# EAGLE design moc2 (EAGLE 8.6.2)
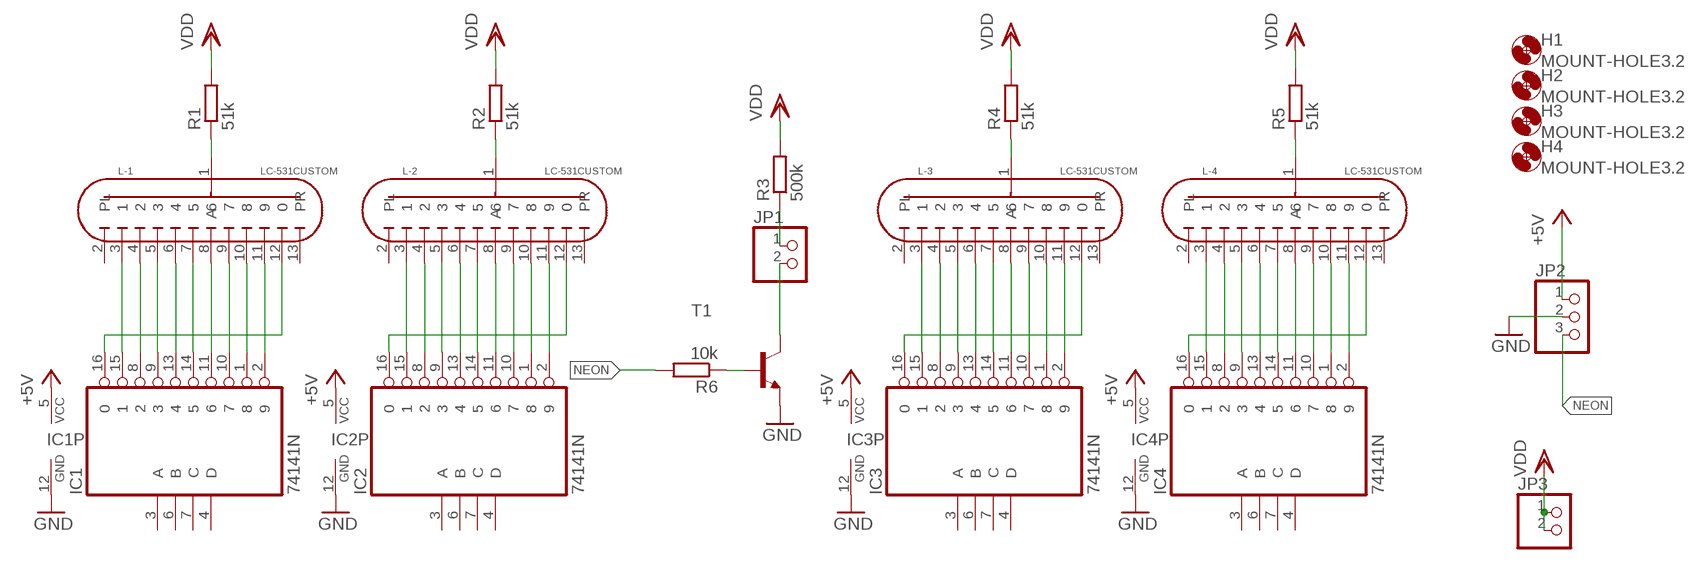
[diagram p0: schematic, sheet 1]

## Parts
H1  MOUNT-HOLE3.2  [3,2]
H2  MOUNT-HOLE3.2  [3,2]
H3  MOUNT-HOLE3.2  [3,2]
H4  MOUNT-HOLE3.2  [3,2]
IC1  74141N  [DIL16]
IC2  74141N  [DIL16]
IC3  74141N  [DIL16]
IC4  74141N  [DIL16]
JP1  PINHD-1X2  [1X02]
JP2  PINHD-1X3/90  [1X03/90]
JP3  PINHD-1X2/90  [1X02/90]
L-1  LC-531CUSTOM  [LC-531_PIN_SOCKET]
L-2  LC-531CUSTOM  [LC-531_PIN_SOCKET]
L-3  LC-531CUSTOM  [LC-531_PIN_SOCKET]
L-4  LC-531CUSTOM  [LC-531_PIN_SOCKET]
R1  51k  R-EU_0207/10  [0207/10]
R2  51k  R-EU_0207/10  [0207/10]
R3  500k  R-EU_0207/10  [0207/10]
R4  51k  R-EU_0207/10  [0207/10]
R5  51k  R-EU_0207/10  [0207/10]
R6  10k  R-EU_0207/10  [0207/10]
T1  BF422-NPN-TO92-BCE  [TO92-BCE]

## Nets
+5V: IC1.5(VCC) IC2.5(VCC) IC3.5(VCC) IC4.5(VCC) JP2.1
GND: IC1.12(GND) IC2.12(GND) IC3.12(GND) IC4.12(GND) JP2.2 T1.E
N$1: IC1.15 L-1.3
N$2: IC1.8 L-1.4
N$3: IC1.9 L-1.5
N$4: IC1.13 L-1.6
N$5: IC1.14 L-1.7
N$6: IC1.11 L-1.8
N$7: IC1.10 L-1.9
N$8: IC1.1 L-1.10
N$9: IC1.2 L-1.11
N$10: IC1.16 L-1.12
N$11: L-1.1(A) R1.1
N$12: IC2.15 L-2.3
N$13: IC2.8 L-2.4
N$14: IC2.9 L-2.5
N$15: IC2.13 L-2.6
N$16: IC2.14 L-2.7
N$17: IC2.11 L-2.8
N$18: IC2.10 L-2.9
N$19: IC2.1 L-2.10
N$20: IC2.2 L-2.11
N$21: IC2.16 L-2.12
N$22: L-2.1(A) R2.1
N$23: JP1.2 T1.C
N$24: JP1.1 R3.1
N$25: IC3.15 L-3.3
N$26: IC3.8 L-3.4
N$27: IC3.9 L-3.5
N$28: IC3.13 L-3.6
N$29: IC3.14 L-3.7
N$30: IC3.11 L-3.8
N$31: IC3.10 L-3.9
N$32: IC3.1 L-3.10
N$33: IC3.2 L-3.11
N$34: IC3.16 L-3.12
N$35: L-3.1(A) R4.1
N$36: IC4.15 L-4.3
N$37: IC4.8 L-4.4
N$38: IC4.9 L-4.5
N$39: IC4.13 L-4.6
N$40: IC4.14 L-4.7
N$41: IC4.11 L-4.8
N$42: IC4.10 L-4.9
N$43: IC4.1 L-4.10
N$44: IC4.2 L-4.11
N$45: IC4.16 L-4.12
N$46: L-4.1(A) R5.1
N$49: R6.1 T1.B
NEON: JP2.3 R6.2
VDD: JP3.1 JP3.2 R1.2 R2.2 R3.2 R4.2 R5.2
Unconnected: IC1.3(A) IC1.4(D) IC1.6(B) IC1.7(C) IC2.3(A) IC2.4(D) IC2.6(B) IC2.7(C) IC3.3(A) IC3.4(D) IC3.6(B) IC3.7(C) IC4.3(A) IC4.4(D) IC4.6(B) IC4.7(C) L-1.2(PL) L-1.13(PR) L-2.2(PL) L-2.13(PR) L-3.2(PL) L-3.13(PR) L-4.2(PL) L-4.13(PR)

## Library data of the parts
H1-H4 = holes:MOUNT-HOLE: MOUNTING HOLE with drill center marker
IC1 IC3 = 74xx-eu:74*141: BCD to decimal DECODER/DRIVER; SPICEPREFIX: X
IC2 IC4 = 74xx-eu:74*141: BCD to decimal DECODER/DRIVER
JP1 JP3 = pinhead:PINHD-1X2: PIN HEADER
JP2 = pinhead:PINHD-1X3: PIN HEADER
L-1-L-4 = Nixie LC-531:LC-531: NIXIE DOLAM LC-531
R1-R6 = resistor:R-EU_: RESISTOR, European symbol
T1 = transistor:*-NPN-: NPN Transistror BF959 corrected 2008.03.06

## Board
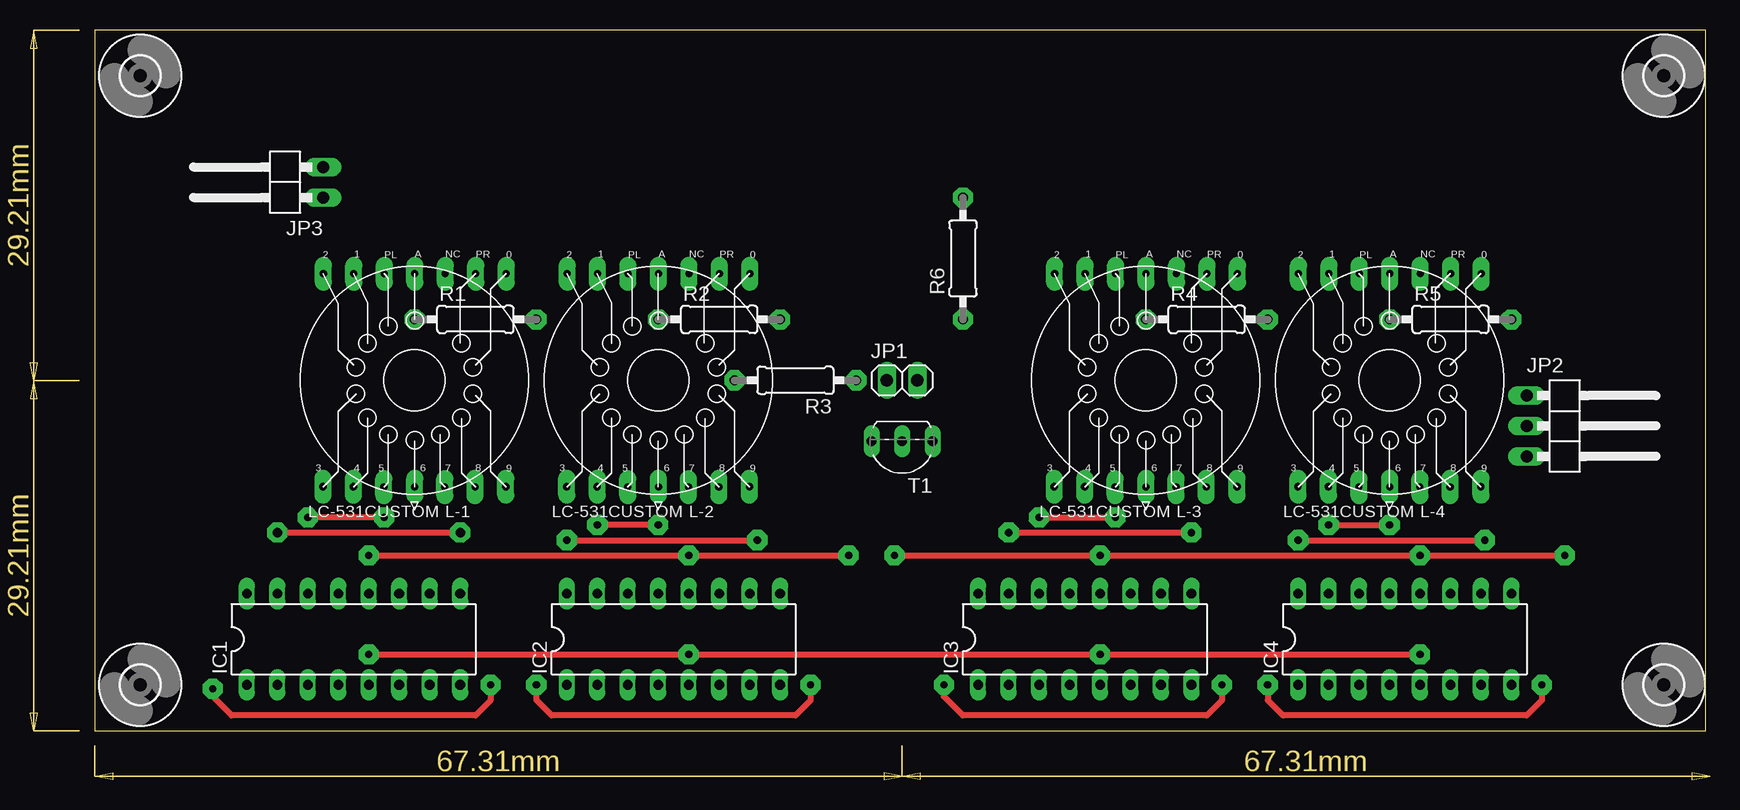
[diagram p1: board, top side]
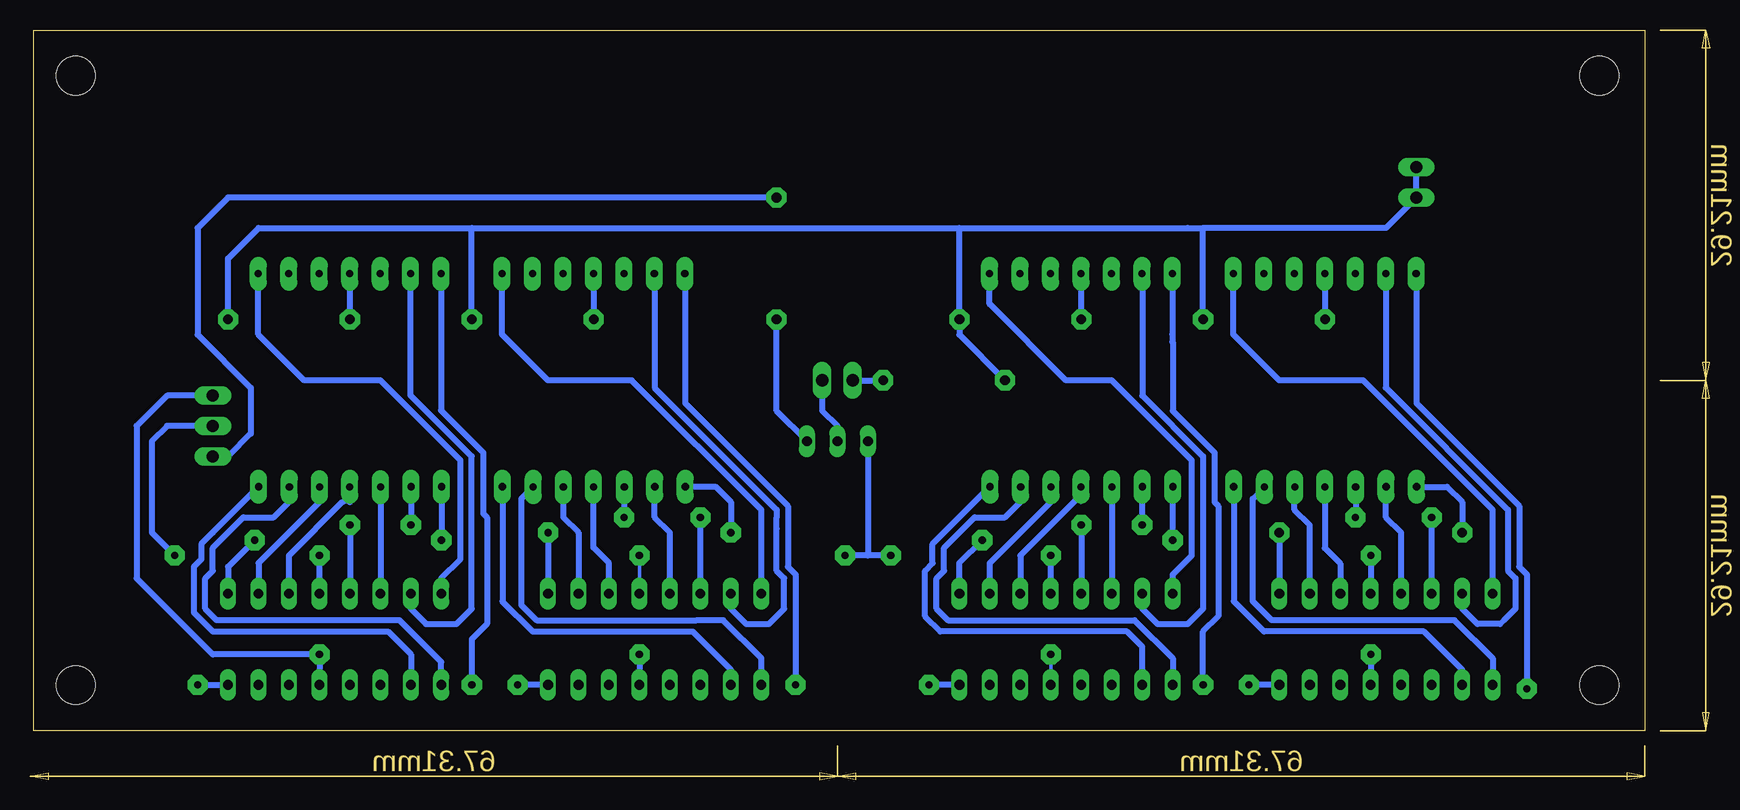
[diagram p2: board, bottom side, seen from below]

Size 134.29 x 58.41 mm. Coordinates in mm from the lower left corner, seen from the top.
Outline: 0,0 134.29,0 134.29,58.41 0,58.41 0,0
Copper layers (1*16): Top 0.035mm / dielectric 1.5mm / Bottom 0.035mm
Design rules "default": minimum track width 6mil, minimum drill 0.35mm, track to track 6mil, track to pad 6mil, pad to pad 6mil, via to via 6mil, smd to smd 6mil, copper to edge 40mil, drill to drill 6mil, minimum pad ring 10mil, minimum via ring 8mil, stop-mask expansion 4mil, vias tented up to drill 0mil, thermal gap 10mil

### Footprints (pad centres in the part's own frame; a part is rotated, then mirrored left to right if it is on the bottom)
3,2 = hole 3.2: 0,0
DIL16 = drill 0.813 long: 1 -8.89,-3.81; 2 -6.35,-3.81; 3 -3.81,-3.81; 4 -1.27,-3.81; 5 1.27,-3.81; 6 3.81,-3.81; 7 6.35,-3.81; 8 8.89,-3.81; 9 8.89,3.81; 10 6.35,3.81; 11 3.81,3.81; 12 1.27,3.81; 13 -1.27,3.81; 14 -3.81,3.81; 15 -6.35,3.81; 16 -8.89,3.81
1X02 = drill 1.016 long: 1 -1.27,0; 2 1.27,0
1X03/90 = drill 1.016 long: 1 -2.54,-3.81; 2 0,-3.81; 3 2.54,-3.81
1X02/90 = drill 1.016 long: 1 -1.27,-3.81; 2 1.27,-3.81
LC-531_PIN_SOCKET = drill 0.6 pad 1.422 long: 1 0.022,8.89; 2 -2.518,8.89; 3 -5.058,8.89; 4 -7.598,8.89; 5 -7.632,-8.866; 6 -5.092,-8.866; 7 -2.556,-8.899; 8 0.022,-8.89; 9 2.524,-8.906; 10 5.05,-8.894; 11 7.608,-8.866; 12 7.642,8.89; 13 5.102,8.89; 14 2.562,8.89
0207/10 = drill 0.813 pad 1.676 octagon: 1 -5.08,0; 2 5.08,0
TO92-BCE = drill 0.813 long: B -2.54,0; C 0,0; E 2.54,0

### Placement (x,y rotation side)
H1  130.81,3.81 0 top
H2  3.81,3.81 0 top
H3  130.81,54.61 0 top
H4  3.81,54.61 0 top
IC1  21.59,7.62 0 top
IC2  48.26,7.62 0 top
IC3  82.55,7.62 0 top
IC4  109.22,7.62 0 top
JP1  67.31,29.21 0 top
JP2  123.19,25.4 270 top
JP3  15.24,45.72 90 top
L-1  26.67,29.21 0 top
L-2  46.99,29.21 0 top
L-3  87.63,29.21 0 top
L-4  107.95,29.21 0 top
R1  31.75,34.29 0 top
R2  52.07,34.29 0 top
R3  58.42,29.21 180 top
R4  92.71,34.29 0 top
R5  113.03,34.29 0 top
R6  72.39,39.37 90 top
T1  67.31,24.13 180 top

### Tracks (layer width: path | path; a pad name or v marks a point on that pad's centre or on a via)
+5V  (via drill 0.6 pad 1.68)
  Top 0.508: v22.86,6.35 v49.53,6.35 v83.82,6.35 v110.49,6.35
  Bottom 0.305: IC2.5 v49.53,6.35
  Bottom 0.508: v22.86,6.35 IC1.5 | v83.82,6.35 IC3.5 | IC4.5 v110.49,6.35 119.38,6.35 125.73,12.7 125.73,25.4 123.19,27.94 JP2.1
GND  (via drill 0.6 pad 1.68)
  Top 0.508: v22.86,14.61 v49.53,14.61 v62.86,14.61 | v122.56,14.61 v110.49,14.61 v83.82,14.61 v66.67,14.61
  Bottom 0.305: IC3.12 v83.82,14.61 | v122.56,14.61 123.19,15.24
  Bottom 0.508: IC2.12 v49.53,14.61 | v22.86,14.61 IC1.12 | IC4.12 v110.49,14.61 | JP2.2 123.19,25.4 124.46,24.13 124.46,16.51 v122.56,14.61 | v62.86,14.61 64.77,14.61 | 64.77,14.61 v66.67,14.61 | T1.E 64.77,14.61
N$1
  Bottom 0.406: 11.75,9.21 12.07,8.89
  Bottom 0.508: IC1.15 15.24,10.16 13.97,8.89 12.07,8.89 | 11.75,9.21 10.79,10.16 10.79,12.7 11.43,13.34 11.43,18.41 21.61,28.6 L-1.3
N$2  (via drill 0.6 pad 1.68)
  Top 0.305: 9.84,2.86 v9.84,3.49
  Top 0.508: v33.02,3.81 33.02,2.54 31.75,1.27 11.43,1.27 9.84,2.86
  Bottom 0.305: L-1.4 19.05,38.08
  Bottom 0.508: 19.05,38.08 19.05,27.3 10.48,18.73 10.48,13.65 9.84,13.02 v9.84,3.49 | IC1.8 v33.02,3.81
N$3  (via drill 0.8 pad 1.68)
  Top 0.508: v15.24,16.51 v30.48,16.51
  Bottom 0.305: L-1.5 19.01,20.32
  Bottom 0.508: v30.48,16.51 IC1.9 | 19.01,20.32 16.51,20.32 15.24,19.05 v15.24,16.51
N$4
  Bottom 0.508: L-1.6 21.58,17.78 20.32,16.52 IC1.13
N$5  (via drill 0.6 pad 1.68)
  Top 0.508: v24.13,17.78 v17.78,17.78
  Bottom 0.305: 24.11,17.8 v24.13,17.78
  Bottom 0.508: IC1.14 v17.78,17.78 | L-1.7 24.11,17.8
N$6
  Bottom 0.508: L-1.8 26.69,15.22 25.4,13.93 IC1.11
N$7
  Bottom 0.305: 29.21,20.29 L-1.9
  Bottom 0.508: IC1.10 27.94,17.14 29.21,18.41 29.21,20.29
N$8
  Bottom 0.406: 31.75,20.29 L-1.10
  Bottom 0.508: IC1.1 12.7,6.03 15.88,9.21 31.12,9.21 32.7,10.79 32.7,19.33 31.75,20.29
N$9
  Bottom 0.305: IC1.2 15.24,5.08
  Bottom 0.406: L-1.11
  Bottom 0.508: L-1.11 34.28,10.78 31.75,8.26 18.41,8.26 15.24,5.08
N$10
  Bottom 0.508: L-1.12 34.31,33.04 30.48,29.21 23.5,29.21 12.7,18.41 IC1.16
N$11
  Bottom 0.305: 26.69,34.31 R1.1
  Bottom 0.508: L-1.1 26.69,34.31
N$12
  Bottom 0.305: L-2.3 41.91,38.08
  Bottom 0.508: IC2.15 41.91,10.16 40.64,8.89 38.1,8.89 36.83,10.16 36.83,22.86 41.91,27.94 41.91,38.08
N$13  (via drill 0.6 pad 1.68)
  Top 0.508: v59.69,3.81 59.69,2.54 58.42,1.27 38.1,1.27 36.83,2.54 v36.83,3.81
  Bottom 0.305: 39.39,33.04 39.37,33.02 | 39.39,32.41 39.37,32.38
  Bottom 0.508: L-2.4 39.39,33.04 39.39,32.41 | 39.37,32.38 39.37,26.67 35.88,23.18 35.88,19.05 35.56,18.73 35.56,9.53 36.83,8.26 v36.83,3.81 | IC2.8 v59.69,3.81
N$14  (via drill 0.6 pad 1.68)
  Top 0.508: v39.37,15.88 v55.24,15.88
  Bottom 0.305: L-2.5
  Bottom 0.508: v39.37,15.88 L-2.5 | v55.24,15.88 57.15,13.97 IC2.9
N$15  (via drill 0.6 pad 1.68)
  Top 0.508: v46.99,17.14 v41.91,17.14
  Bottom 0.305: L-2.6 41.9,20.32 41.91,20.31
  Bottom 0.508: v46.99,17.14 IC2.13 | v41.91,17.14 41.91,20.31
N$16
  Bottom 0.406: 44.43,11.45 IC2.14
  Bottom 0.508: L-2.7 44.43,11.45
N$17
  Bottom 0.305: 47.01,19.03 L-2.8 47.01,19.66
  Bottom 0.508: 47.01,19.66 52.07,14.61 IC2.11
N$18
  Bottom 0.305: 49.53,19.05 49.51,19.07 L-2.9
  Bottom 0.406: 49.53,19.05 49.53,20.29
  Bottom 0.508: IC2.10 54.61,13.97 49.53,19.05
N$19
  Bottom 0.305: 52.04,19.08 L-2.10
  Bottom 0.406: 39.37,5.08 IC2.1
  Bottom 0.508: IC2.1 39.37,6.03 42.54,9.21 58.1,9.21 59.05,10.16 59.05,12.7 58.42,13.34 58.42,15.24 55.88,17.78 53.34,17.78 52.04,19.08
N$20
  Bottom 0.406: 41.91,5.08 IC2.2 | 54.62,20.32 L-2.11
  Bottom 0.508: IC2.2 41.91,6.99 43.18,8.26 58.74,8.26 60.01,9.53 60.01,13.34 59.37,13.97 59.37,15.57 L-2.11
N$21
  Bottom 0.305: 39.37,12.7 IC2.16
  Bottom 0.508: IC2.16 39.37,13.02 37.78,14.61 37.78,22.54 44.45,29.21 48.26,29.21 54.61,35.56 54.63,35.56 L-2.12
N$22
  Bottom 0.305: 47.01,34.31 R2.1
  Bottom 0.508: L-2.1 47.01,34.31
N$23
  Bottom 0.305: 67.31,25.4 T1.C
  Bottom 0.508: JP1.2 68.58,26.67 67.31,25.4
N$24
  Bottom 0.508: JP1.1 R3.1
N$25
  Bottom 0.305: IC3.15 76.2,10.16 | L-3.3 82.55,38.08
  Bottom 0.508: 76.2,10.16 74.93,8.89 73.03,8.89 71.76,10.16 71.76,12.7 72.39,13.34 72.39,16.83 72.39,17.78 72.39,18.41 82.55,28.57 82.55,38.08
N$26  (via drill 0.6 pad 1.68)
  Top 0.305: 70.8,2.86 v70.8,3.81
  Top 0.508: v93.98,3.81 93.98,2.54 92.71,1.27 72.39,1.27 70.8,2.86
  Bottom 0.305: L-3.4 80.01,38.08
  Bottom 0.508: 80.01,38.08 80.01,27.3 71.44,18.73 71.44,13.65 70.8,13.02 v70.8,3.81 | IC3.8 v93.98,3.81
N$27  (via drill 0.6 pad 1.68)
  Top 0.508: v76.2,16.51 v91.44,16.51
  Bottom 0.508: L-3.5 77.49,20.34 76.2,19.05 v76.2,16.51 | v91.44,16.51 IC3.9
N$28
  Bottom 0.305: 82.55,17.78 82.54,17.79
  Bottom 0.508: IC3.13 81.28,16.51 82.55,17.78 | 82.54,17.79 L-3.6
N$29  (via drill 0.6 pad 1.68)
  Top 0.508: v78.74,17.78 v85.09,17.78
  Bottom 0.305: v85.09,17.78 85.07,17.8
  Bottom 0.508: IC3.14 v78.74,17.78 | 85.07,17.8 L-3.7
N$30
  Bottom 0.508: IC3.11 86.36,13.97 87.65,15.26 L-3.8
N$31
  Bottom 0.305: L-3.9 90.17,20.29
  Bottom 0.508: 90.17,20.29 90.17,17.78 88.9,16.51 IC3.10
N$32
  Bottom 0.508: L-3.10 93.66,19.33 93.66,10.48 92.39,9.21 79.06,9.21 76.84,9.21 73.66,6.03 IC3.1
N$33
  Bottom 0.305: 95.24,10.81 95.25,10.79
  Bottom 0.508: L-3.11 95.24,10.81 | 95.25,10.79 92.71,8.26 79.38,8.26 76.2,5.08 IC3.2
N$34
  Bottom 0.508: IC3.16 73.66,18.41 84.45,29.21 91.44,29.21 95.27,33.04 L-3.12
N$35
  Bottom 0.305: L-3.1 87.63,38.08
  Bottom 0.508: 87.63,38.08 R4.1
N$36
  Bottom 0.508: IC4.15 102.87,10.16 101.6,8.89 99.06,8.89 97.79,10.16 97.79,22.86 102.89,27.96 L-4.3
N$37  (via drill 0.6 pad 1.68)
  Top 0.508: v97.79,3.81 97.79,2.54 99.06,1.27 119.38,1.27 120.65,2.54 v120.65,3.81
  Bottom 0.508: L-4.4 100.35,26.69 96.84,23.18 96.84,18.1 96.52,17.78 96.52,8.89 97.79,7.62 v97.79,3.81 | v120.65,3.81 IC4.8
N$38  (via drill 0.6 pad 1.68)
  Top 0.508: v100.33,15.88 v115.89,15.88
  Bottom 0.305: 100.32,15.89 v100.33,15.88 | 116.2,15.88 v115.89,15.88
  Bottom 0.508: L-4.5 100.32,15.89 | v115.89,15.88 118.11,13.65 IC4.9
N$39  (via drill 0.6 pad 1.68)
  Top 0.508: v102.87,17.14 v107.95,17.14
  Bottom 0.305: L-4.6
  Bottom 0.508: L-4.6 v102.87,17.14 | v107.95,17.14 IC4.13
N$40
  Bottom 0.305: 105.39,11.45 IC4.14
  Bottom 0.508: L-4.7 105.39,11.45
N$41
  Bottom 0.305: 108.59,19.05 107.95,19.05 | 107.95,20.3 L-4.8
  Bottom 0.508: 108.59,19.05 113.03,14.61 IC4.11 | 107.95,19.05 107.95,20.3
N$42
  Bottom 0.508: L-4.9 110.47,19.07 115.57,13.97 IC4.10
N$43
  Bottom 0.305: 113,19.08 L-4.10
  Bottom 0.508: IC4.1 100.33,5.71 103.82,9.21 119.06,9.21 120.02,10.16 120.02,12.7 119.38,13.34 119.38,15.24 116.84,17.78 114.3,17.78 113,19.08
N$44
  Bottom 0.305: 119.38,16.52 119.38,16.51
  Bottom 0.508: L-4.11 119.38,16.52 | 119.38,16.51 120.33,15.56 120.33,14.29 120.97,13.65 120.97,9.84 119.38,8.26 104.78,8.26 102.87,6.35 IC4.2
N$45
  Bottom 0.508: IC4.16 100.33,12.7 98.74,14.29 98.74,22.54 105.41,29.21 111.76,29.21 115.59,33.04 L-4.12
N$46
  Bottom 0.305: 107.97,34.31 R5.1
  Bottom 0.508: L-4.1 107.97,34.31
N$49
  Bottom 0.508: T1.B 72.39,26.67 R6.1
NEON
  Bottom 0.508: R6.2 118.11,44.45 120.65,41.91 120.65,33.02 116.2,28.57 116.2,24.77 118.11,22.86 JP2.3
VDD
  Bottom 0.508: R1.2 36.83,41.91 | 97.79,41.91 57.15,41.91 | 57.15,41.91 38.1,41.91 36.83,41.91 | R4.2 97.79,41.91 | R5.2 118.11,39.37 115.57,41.91 97.79,41.91 | 57.15,41.91 R2.2 57.15,33.02 R3.2 | JP3.2 JP3.1 21.59,41.91 36.83,41.91